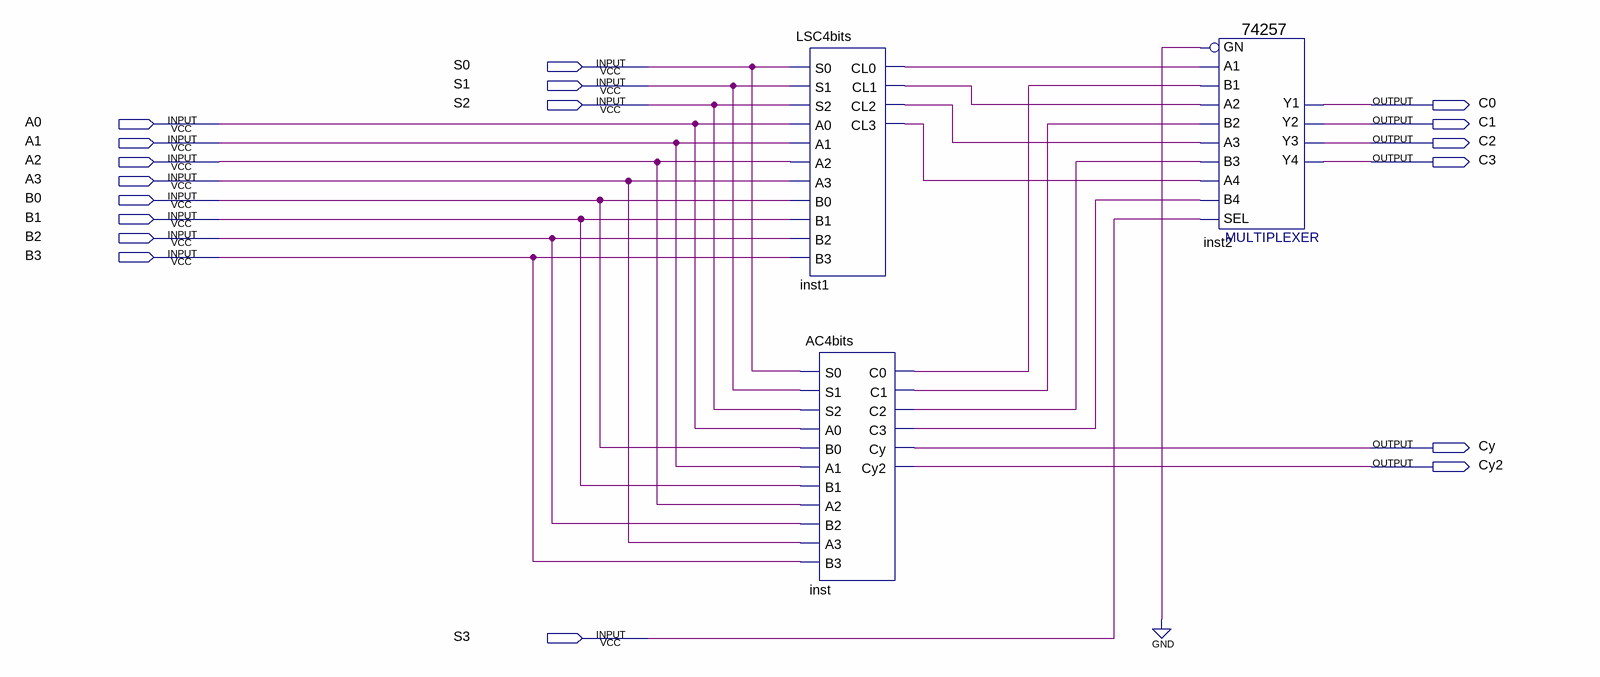
[diagram p0: schematic sheet]
// Quartus schematic ALU.bdf as structural Verilog: 3 symbols, 18 pins
module ALU (
  input  S0,
  input  S1,
  input  S2,
  input  A0,
  input  A1,
  input  A2,
  input  A3,
  input  B0,
  input  B1,
  input  B2,
  input  B3,
  input  S3,
  output C0,
  output C1,
  output C2,
  output C3,
  output Cy,
  output Cy2
);

  wire inst1_cl0, inst1_cl1, inst1_cl2, inst1_cl3, inst_c0, inst_c1, inst_c2, inst_c3;

  LSC4bits inst1 (
    .S0(S0), .S1(S1), .S2(S2), .A0(A0), .A1(A1), .A2(A2), .A3(A3), .B0(B0), .B1(B1), .B2(B2), .B3(B3),
    .CL0(inst1_cl0), .CL1(inst1_cl1), .CL2(inst1_cl2), .CL3(inst1_cl3));
  AC4bits inst (
    .S0(S0), .S1(S1), .S2(S2), .A0(A0), .B0(B0), .A1(A1), .B1(B1), .A2(A2), .B2(B2), .A3(A3), .B3(B3),
    .C0(inst_c0), .C1(inst_c1), .C2(inst_c2), .C3(inst_c3), .Cy(Cy), .Cy2(Cy2));
  \74257  inst2 (
    .B1(inst_c0), .A1(inst1_cl0), .B3(inst_c2), .A2(inst1_cl1), .B2(inst_c1), .A3(inst1_cl2), .A4(inst1_cl3),
    .B4(inst_c3), .SEL(S3), .GN(1'b0), .Y2(C1), .Y3(C2), .Y4(C3), .Y1(C0));
endmodule
